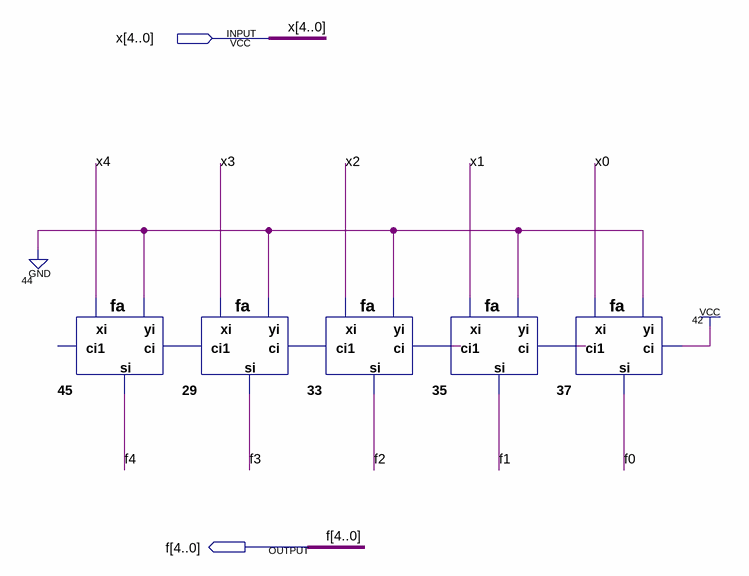
[diagram p0: schematic sheet]
// Quartus schematic inc5.bdf as structural Verilog: 5 symbols, 2 pins
module inc5 (
  input  [4:0] x,
  output [4:0] f
);

  wire n29_ci1, n33_ci1, n35_ci1, n37_ci1;

  fa u_45 (.xi(x[4]), .ci(n29_ci1), .yi(1'b0), .si(f[4]));  // open: ci1
  fa u_29 (.xi(x[3]), .ci(n33_ci1), .yi(1'b0), .ci1(n29_ci1), .si(f[3]));
  fa u_33 (.xi(x[2]), .ci(n35_ci1), .yi(1'b0), .ci1(n33_ci1), .si(f[2]));
  fa u_35 (.xi(x[1]), .ci(n37_ci1), .yi(1'b0), .ci1(n35_ci1), .si(f[1]));
  fa u_37 (.xi(x[0]), .ci(1'b1), .yi(1'b0), .ci1(n37_ci1), .si(f[0]));
endmodule
